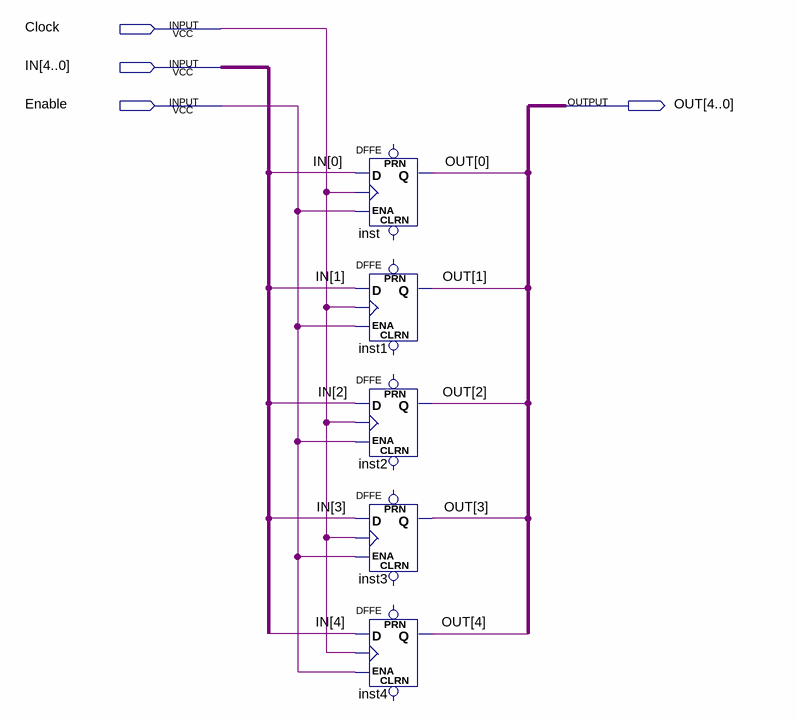
[diagram p0: schematic sheet]
// Quartus schematic registrador4.bdf as structural Verilog: 5 symbols, 4 pins
module registrador4 (
  input  Clock,
  input  [4:0] IN,
  input  Enable,
  output [4:0] OUT
);

  DFFE inst (.D(IN[0]), .CLK(Clock), .ENA(Enable), .Q(OUT[0]));  // open: PRN, CLRN
  DFFE inst1 (.D(IN[1]), .CLK(Clock), .ENA(Enable), .Q(OUT[1]));  // open: PRN, CLRN
  DFFE inst2 (.D(IN[2]), .CLK(Clock), .ENA(Enable), .Q(OUT[2]));  // open: PRN, CLRN
  DFFE inst3 (.D(IN[3]), .CLK(Clock), .ENA(Enable), .Q(OUT[3]));  // open: PRN, CLRN
  DFFE inst4 (.D(IN[4]), .CLK(Clock), .ENA(Enable), .Q(OUT[4]));  // open: PRN, CLRN
endmodule
